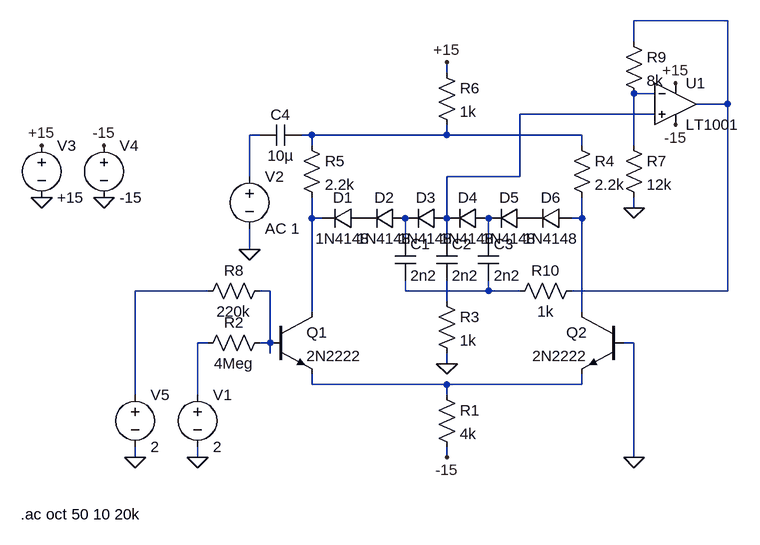
[diagram p0: schematic Dynamix.asc]
Dynamix.asc, the LTspice schematic file:
Version 4
SHEET 1 1360 680
WIRE 688 -160 544 -160
WIRE 544 -128 544 -160
WIRE 256 -80 256 -96
WIRE 576 -48 544 -48
WIRE 688 -32 688 -160
WIRE 688 -32 640 -32
WIRE 576 -16 368 -16
WIRE -32 16 -48 16
WIRE 48 16 32 16
WIRE 256 16 256 0
WIRE 256 16 48 16
WIRE 464 16 256 16
WIRE 48 32 48 16
WIRE 464 32 464 16
WIRE 544 32 544 -48
WIRE -48 80 -48 16
WIRE 368 80 368 -16
WIRE 368 80 256 80
WIRE 544 128 544 112
WIRE 48 144 48 112
WIRE 64 144 48 144
WIRE 256 144 256 80
WIRE 464 144 464 112
WIRE 464 144 448 144
WIRE 192 176 192 144
WIRE 256 176 256 144
WIRE 320 176 320 144
WIRE -48 192 -48 160
WIRE -112 256 -224 256
WIRE -16 256 -32 256
WIRE 192 256 192 240
WIRE 320 256 320 240
WIRE 320 256 192 256
WIRE 368 256 320 256
WIRE 688 256 688 -32
WIRE 688 256 448 256
WIRE 256 272 256 240
WIRE 48 288 48 144
WIRE 464 288 464 144
WIRE -112 336 -128 336
WIRE -16 336 -16 256
WIRE -16 336 -32 336
WIRE 544 336 528 336
WIRE -16 352 -16 336
WIRE 256 368 256 352
WIRE 48 400 48 384
WIRE 256 400 48 400
WIRE 464 400 464 384
WIRE 464 400 256 400
WIRE -224 416 -224 256
WIRE -128 416 -128 336
WIRE 256 416 256 400
WIRE -224 512 -224 496
WIRE -128 512 -128 496
WIRE 256 512 256 496
WIRE 544 512 544 336
FLAG 256 512 -15
FLAG -128 512 0
FLAG 544 512 0
FLAG -48 192 0
FLAG 256 -96 +15
FLAG -368 112 0
FLAG -272 112 0
FLAG -368 32 +15
FLAG -272 32 -15
FLAG 608 0 -15
FLAG 608 -64 +15
FLAG 544 128 0
FLAG 256 368 0
FLAG -224 512 0
SYMBOL diode 128 128 R90
WINDOW 0 0 32 VBottom 0
WINDOW 3 32 32 VTop 0
SYMATTR InstName D1
SYMATTR Value 1N4148
SYMBOL diode 192 128 R90
WINDOW 0 0 32 VBottom 0
WINDOW 3 32 32 VTop 0
SYMATTR InstName D2
SYMATTR Value 1N4148
SYMBOL diode 256 128 R90
WINDOW 0 0 32 VBottom 0
WINDOW 3 32 32 VTop 0
SYMATTR InstName D3
SYMATTR Value 1N4148
SYMBOL diode 320 128 R90
WINDOW 0 0 32 VBottom 0
WINDOW 3 32 32 VTop 0
SYMATTR InstName D4
SYMATTR Value 1N4148
SYMBOL diode 384 128 R90
WINDOW 0 0 32 VBottom 0
WINDOW 3 32 32 VTop 0
SYMATTR InstName D5
SYMATTR Value 1N4148
SYMBOL diode 448 128 R90
WINDOW 0 0 32 VBottom 0
WINDOW 3 32 32 VTop 0
SYMATTR InstName D6
SYMATTR Value 1N4148
SYMBOL npn -16 288 R0
SYMATTR InstName Q1
SYMATTR Value 2N2222
SYMBOL npn 528 288 M0
SYMATTR InstName Q2
SYMATTR Value 2N2222
SYMBOL res 240 400 R0
SYMATTR InstName R1
SYMATTR Value 4k
SYMBOL voltage -128 400 R0
WINDOW 123 0 0 Left 0
WINDOW 39 0 0 Left 0
SYMATTR InstName V1
SYMATTR Value 2
SYMBOL res 448 16 R0
SYMATTR InstName R4
SYMATTR Value 2.2k
SYMBOL res 32 16 R0
SYMATTR InstName R5
SYMATTR Value 2.2k
SYMBOL voltage -48 64 R0
WINDOW 123 0 0 Left 0
WINDOW 39 0 0 Left 0
SYMATTR InstName V2
SYMATTR Value AC 1
SYMBOL res 240 -96 R0
SYMATTR InstName R6
SYMATTR Value 1k
SYMBOL voltage -368 16 R0
WINDOW 123 0 0 Left 0
WINDOW 39 0 0 Left 0
SYMATTR InstName V3
SYMATTR Value +15
SYMBOL voltage -272 16 R0
WINDOW 123 0 0 Left 0
WINDOW 39 0 0 Left 0
SYMATTR InstName V4
SYMATTR Value -15
SYMBOL res -16 320 R90
WINDOW 0 0 56 VBottom 0
WINDOW 3 32 56 VTop 0
SYMATTR InstName R2
SYMATTR Value 4Meg
SYMBOL Opamps\\LT1001 608 -96 R0
SYMATTR InstName U1
SYMBOL res 528 16 R0
SYMATTR InstName R7
SYMATTR Value 12k
SYMBOL res 528 -144 R0
SYMATTR InstName R9
SYMATTR Value 8k
SYMBOL cap 32 0 R90
WINDOW 0 0 32 VBottom 0
WINDOW 3 32 32 VTop 0
SYMATTR InstName C4
SYMATTR Value 10µ
SYMBOL cap 304 176 R0
SYMATTR InstName C3
SYMATTR Value 2n2
SYMBOL res 240 256 R0
SYMATTR InstName R3
SYMATTR Value 1k
SYMBOL res -16 240 R90
WINDOW 0 0 56 VBottom 0
WINDOW 3 32 56 VTop 0
SYMATTR InstName R8
SYMATTR Value 220k
SYMBOL voltage -224 400 R0
WINDOW 123 0 0 Left 0
WINDOW 39 0 0 Left 0
SYMATTR InstName V5
SYMATTR Value 2
SYMBOL cap 176 176 R0
SYMATTR InstName C1
SYMATTR Value 2n2
SYMBOL res 464 240 R90
WINDOW 0 0 56 VBottom 0
WINDOW 3 32 56 VTop 0
SYMATTR InstName R10
SYMATTR Value 1k
SYMBOL cap 240 176 R0
SYMATTR InstName C2
SYMATTR Value 2n2
TEXT -400 600 Left 0 !.ac oct 50 10 20k

The netlist it stands for:
* Dynamix.asc
D1 P001 N006 1N4148
D2 N008 P001 1N4148
D3 N003 N008 1N4148
D4 N009 N003 1N4148
D5 P002 N009 1N4148
D6 N007 P002 1N4148
Q1 N006 N011 N015 0 2N2222
Q2 N007 0 N015 0 2N2222
R1 N015 -15 4k
V1 N014 0 2
R4 N005 N007 2.2k
R5 N005 N006 2.2k
V2 N004 0 AC 1
R6 +15 N005 1k
V3 +15 0 +15
V4 -15 0 -15
R2 N011 N014 4Meg
XU1 N003 N002 +15 -15 N001 LT1001  ; pins In+ In- V+ V- OUT
R7 N002 0 12k
R9 N001 N002 8k
C4 N005 N004 10µ
C3 N009 N012 2n2
R3 N013 0 1k
R8 N011 N010 220k
V5 N010 0 2
C1 N008 N012 2n2
R10 N001 N012 1k
C2 N003 N013 2n2
.model D D
.lib standard.dio
.model NPN NPN
.model PNP PNP
.lib standard.bjt
.ac oct 50 10 20k
.lib LTC.lib
.backanno
.end